# Altium project Analog Hall Board.PrjPcb
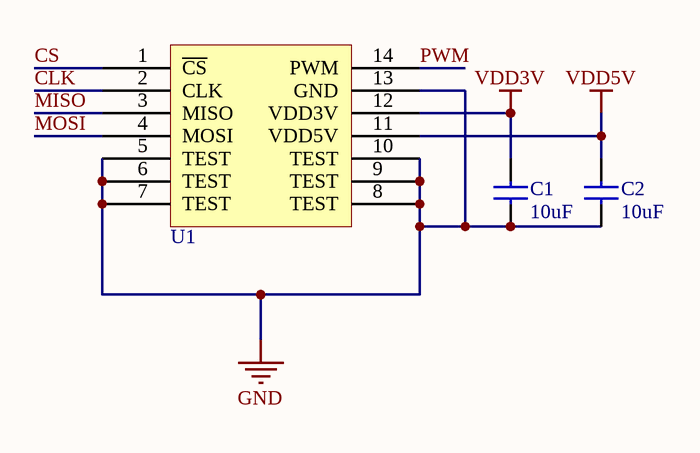
[diagram p0: Analog Hall Board.SchDoc]
1 sheet, 3 parts. Net scope: global (net labels, ports and power ports of the same name join across sheets).
Board file: Analog Hall Board.PcbDoc

## Sheet Analog Hall Board.SchDoc
size A

### Parts
C1  value 10uF  [0603_cap]  (hidden comment: CAP 0603)
C2  value 10uF  [0603_cap]  (hidden comment: CAP 0603)
U1  AS5048A Analog Hall Sensor  [TSOP65P640X120-14N]  (value not drawn)

### Nets
GND: C1.2 C2.2 U1.5(TEST) U1.6(TEST) U1.7(TEST) U1.8(TEST) U1.9(TEST) U1.10(TEST) U1.13(GND)
VDD3V: C1.1 U1.12(VDD3V)
VDD5V: C2.1 U1.11(VDD5V)
CLK: U1.2(CLK)
CS: U1.1(~{CS})
MISO: U1.3(MISO)
MOSI: U1.4(MOSI)
PWM: U1.14(PWM)

### Library data of the parts
C1 C2 = C_0603: CAP CERM 0603; Known Distributors: Digikey; Package: 0603
U1 = U_AS5048A: IC ENCODER ROTARY 14-TSSOP; Manufacturer: ams; SVP Creator: Thomas Daede; Package: AS5048A-HTSP-500; ComponentLink1Description: Datasheet; ComponentLink1URL: SVN Datasheet URL; Price: 12.9300